# Altium project Hat.PrjPcb
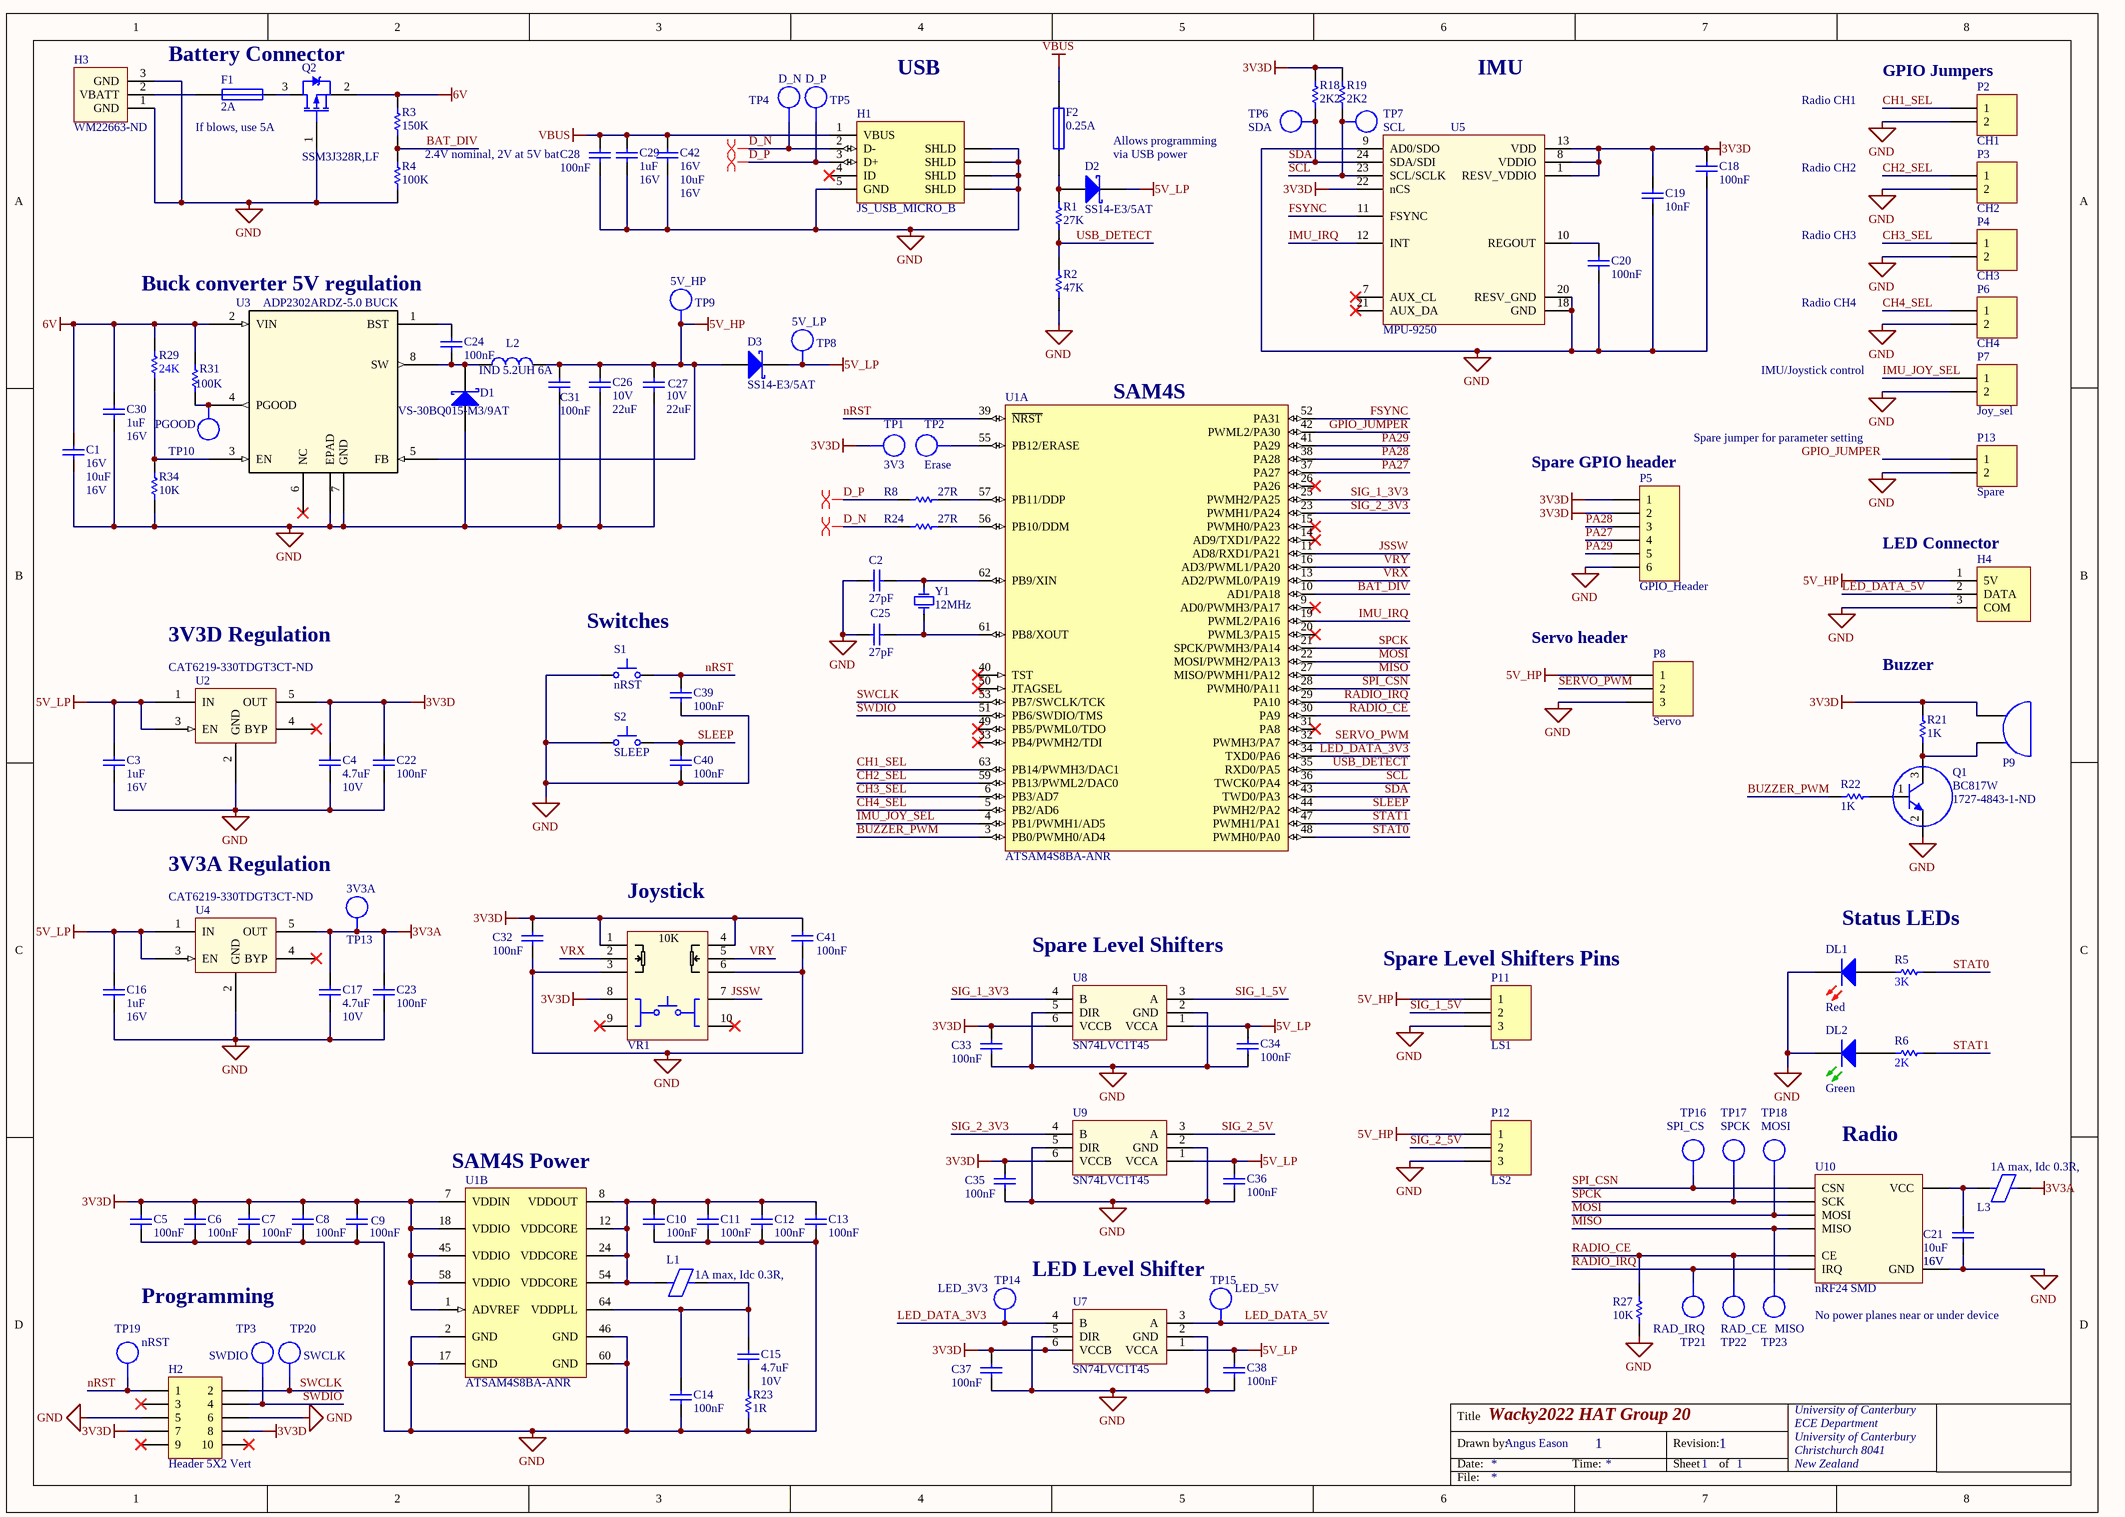
[diagram p0: MCU.SchDoc]
1 sheet, 120 parts. Net scope: global (net labels, ports and power ports of the same name join across sheets).
Board file: hat.PcbDoc

## Sheet MCU.SchDoc: Wacky2022 HAT Group 20
size A3; DrawnBy: Angus Eason; Organization: University of Canterbury; Address1: ECE Department; Address2: University of Canterbury; Address3: Christchurch 8041; Address4: New Zealand; DocumentNumber: 1; Revision: 1; SheetNumber: 1; SheetTotal: 1; ImagePath: C:\Users\angus\Documents\Altium\Templates\uc-logo.png

### Parts
C1  Voltage - Rated: 16V  [CAPC2012L]  (hidden comment: 10uF)
C2  27pF  [CAPC1608L]
C3  Max Voltage: 16V  [CAPC1608L]  (hidden comment: 1uF)
C4  Max Voltage: 10V  [CAPC1608N]  (hidden comment: 4.7uF)
C5  100nF  [CAPC1608L]
C6  100nF  [CAPC1608L]
C7  100nF  [CAPC1608L]
C8  100nF  [CAPC1608L]
C9  100nF  [CAPC1608L]
C10  100nF  [CAPC1608L]
C11  100nF  [CAPC1608L]
C12  100nF  [CAPC1608L]
C13  100nF  [CAPC1608L]
C14  100nF  [CAPC1608L]
C15  Max Voltage: 10V  [CAPC1608N]  (hidden comment: 4.7uF)
C16  Max Voltage: 16V  [CAPC1608L]  (hidden comment: 1uF)
C17  Max Voltage: 10V  [CAPC1608N]  (hidden comment: 4.7uF)
C18  100nF  [CAPC1608L]
C19  10nF  [CAPC1608L]
C20  100nF  [CAPC1608L]
C21  Voltage - Rated: 16V  [CAPC2012L]  (hidden comment: 10uF)
C22  100nF  [CAPC1608L]
C23  100nF  [CAPC1608L]
C24  100nF  [CAPC1608L]
C25  27pF  [CAPC1608L]
C26  Max Voltage: 10V  [CAPC3216L]  (hidden comment: 22uF)
C27  Max Voltage: 10V  [CAPC3216L]  (hidden comment: 22uF)
C28  100nF  [CAPC1608L]
C29  Max Voltage: 16V  [CAPC1608L]  (hidden comment: 1uF)
C30  Max Voltage: 16V  [CAPC1608L]  (hidden comment: 1uF)
C31  100nF  [CAPC1608L]
C32  100nF  [CAPC1608L]
C33  100nF  [CAPC1608L]
C34  100nF  [CAPC1608L]
C35  100nF  [CAPC1608L]
C36  100nF  [CAPC1608L]
C37  100nF  [CAPC1608L]
C38  100nF  [CAPC1608L]
C39  100nF  [CAPC1608L]
C40  100nF  [CAPC1608L]
C41  100nF  [CAPC1608L]
C42  Voltage - Rated: 16V  [CAPC2012L]  (hidden comment: 10uF)
D1  VS-30BQ015-M3/9AT  [SMC]
D2  SS14-E3/5AT  [DIOM4227X23N]
D3  SS14-E3/5AT  [DIOM4227X23N]
DL1  Red  [WL-SMCW0603]
DL2  Green  [WL-SMCW0603]
F1  2A  [RESC3216N]
F2  0.25A  [RESC3216N]
H1  JS_USB_MICRO_B  [FCI_USB_10118194-0001LF]
H2  Header 5X2 Vert  [IDC2.54-V10D]
H3  Supplier Part Number 1: WM22663-ND  [BATT_HEADER_3POS]  (hidden comment: Battery_HEADER_3pin)
H4  LED_Strip  [MOLEX_KK_3_HDR]  (value not drawn)
L1  1A max, Idc 0.3R,  [INDC3216L]
L2  IND 5.2UH 6A  [INDUCTOR5u2]
L3  1A max, Idc 0.3R,  [INDC3216L]
P2  CH1  [HDR1X2]
P3  CH2  [HDR1X2]
P4  CH3  [HDR1X2]
P5  GPIO_Header  [HDR1X6]
P6  CH4  [HDR1X2]
P7  Joy_sel  [HDR1X2]
P8  Servo  [HDR1X3]
P9  Piezo Buzzer  [BUZZER]  (value not drawn)
P11  LS1  [HDR1X3]
P12  LS2  [HDR1X3]
P13  Spare  [HDR1X2]
Q1  Supplier Part Number 2: 1727-4843-1-ND  [SOT323_M]  (hidden comment: BC817W)
Q2  SSM3J328R,LF  [SOT23_L]
R1  27K  [RESC1608L]
R2  47K  [RESC1608N]
R3  150K  [RESC1608L]
R4  100K  [RESC1608L]
R5  3K  [RESC1608L]
R6  2K  [RESC1608L]
R8  27R  [RESC1608L]
R18  2K2  [RESC1608L]
R19  2K2  [RESC1608L]
R21  1K  [RESC1608L]
R22  1K  [RESC1608L]
R23  1R  [RESC3216L]
R24  27R  [RESC1608L]
R27  10K  [RESC1608L]
R29  24K  [RESC1608L]
R31  100K  [RESC1608L]
R34  10K  [RESC1608L]
S1  nRST  [EVQPNF05M]
S2  SLEEP  [EVQPNF05M]
TP1  3V3  [TP_1206]  (no BOM)
TP2  Erase  [TP_1206]  (no BOM)
TP3  SWDIO  [TP_1206]  (no BOM)
TP4  D_N  [TP_1206]  (no BOM)
TP5  D_P  [TP_1206]  (no BOM)
TP6  SDA  [TP_1206]  (no BOM)
TP7  SCL  [TP_1206]  (no BOM)
TP8  5V_LP  [TP_1206]  (no BOM)
TP9  5V_HP  [TP_1206]  (no BOM)
TP10  PGOOD  [TP_1206]  (no BOM)
TP13  3V3A  [TP_1206]  (no BOM)
TP14  LED_3V3  [TP_1206]  (no BOM)
TP15  LED_5V  [TP_1206]  (no BOM)
TP16  SPI_CS  [TP_1206]  (no BOM)
TP17  SPCK  [TP_1206]  (no BOM)
TP18  MOSI  [TP_1206]  (no BOM)
TP19  nRST  [TP_1206]  (no BOM)
TP20  SWCLK  [TP_1206]  (no BOM)
TP21  RAD_IRQ  [TP_1206]  (no BOM)
TP22  RAD_CE  [TP_1206]  (no BOM)
TP23  MISO  [TP_1206]  (no BOM)
U1  ATSAM4S8BA-ANR  [LQFP64_L]  (parts A,B of 2)
U2  Supplier Part Number: CAT6219-330TDGT3CT-ND  [SOT95P280X145-5N]  (hidden comment: CAT6219-330TDGT3)
U3  ADP2302ARDZ-5.0 BUCK  [RD_8_1]
U4  Supplier Part Number: CAT6219-330TDGT3CT-ND  [SOT95P280X145-5N]  (hidden comment: CAT6219-330TDGT3)
U5  MPU-9250  [Quad24]
U7  SN74LVC1T45  [SOT23-6_N]
U8  SN74LVC1T45  [SOT23-6_N]
U9  SN74LVC1T45  [SOT23-6_N]
U10  nRF24 SMD  Warning: No power planes near or under device  [NRF24]
VR1  Joystick 10k with Sw  [Joystick_Sw]  (value not drawn)
Y1  12MHz  [6.0X3.5-4]

### Nets
3V3A: C17.2 C23.2 L3.2 TP13.1 U4.5(OUT)
3V3D: C4.2 C5.2 C6.2 C7.2 C8.2 C9.2 C18.1 C19.2 C22.2 C32.2 C33.2 C35.2 C37.2 C41.2 H2.7 H2.8 P5.1 P5.2 P9.1 R18.2 R19.2 R21.2 TP1.1 U1.1(ADVREF) U1.7(VDDIN) U1.18(VDDIO) U1.45(VDDIO) U1.58(VDDIO) U2.5(OUT) U5.1(RESV_VDDIO) U5.8(VDDIO) U5.13(VDD) U5.22(nCS) U7.6(VCCB) U8.6(VCCB) U9.6(VCCB) VR1.1 VR1.4(1') VR1.8
5V_HP: C26.2 C27.2 C31.1 D3.2(A) H4.1(5V) L2.2 P8.1 P11.1 P12.1 TP9.1 U3.5(FB)
5V_LP: C3.2 C16.2 C34.1 C36.1 C38.1 D2.1(K) D3.1(K) TP8.1 U2.1(IN) U2.3(EN) U4.1(IN) U4.3(EN) U7.1(VCCA) U8.1(VCCA) U9.1(VCCA)
6V: C1.2 C30.2 Q2.2 R3.2 R29.2 R31.2 U3.2(VIN)
GND: C1.1 C2.1 C3.1 C4.1 C5.1 C6.1 C7.1 C8.1 C9.1 C10.1 C11.1 C12.1 C13.1 C14.1 C16.1 C17.1 C18.2 C19.1 C20.1 C21.1 C22.1 C23.1 C25.1 C26.1 C27.1 C28.1 C29.1 C30.1 C31.2 C32.1 C33.1 C34.2 C35.1 C36.2 C37.1 C38.2 C39.2 C40.2 C41.1 C42.1 D1.1(A) DL1.1(K) DL2.1(K) H1.5(GND) H1.6(SHLD) H2.5 H2.6 H3.1(GND) H3.3(GND) H4.3(COM) P2.2 P3.2 P4.2 P5.6 P6.2 P7.2 P8.3 P11.3 P12.3 P13.2 Q1.2 Q2.1 R2.1 R4.1 R23.1 R27.1 R34.1 S1.1 S2.1 U1.2(GND) U1.17(GND) U1.46(GND) U1.60(GND) U2.2(GND) U3.7(GND) U3.EPAD U4.2(GND) U5.9(AD0/SDO) U5.18(GND) U5.20(RESV_GND) U7.2(GND) U7.5(DIR) U8.2(GND) U8.5(DIR) U9.2(GND) U9.5(DIR) U10.2(GND) VR1.3 VR1.6(3')
VBUS: C28.2 C29.2 C42.2 F2.2 H1.1(VBUS)
BAT_DIV: R3.1 R4.2 U1.10(AD1/PA18)
BUZZER_PWM: R22.2 U1.3(PB0/PWMH0/AD4)
CH1_SEL: P2.1 U1.63(PB14/PWMH3/DAC1)
CH2_SEL: P3.1 U1.59(PB13/PWML2/DAC0)
CH3_SEL: P4.1 U1.6(PB3/AD7)
CH4_SEL: P6.1 U1.5(PB2/AD6)
D_N: H1.2(D-) R24.1 TP4.1
D_P: H1.3(D+) R8.1 TP5.1
FSYNC: U1.52(PA31) U5.11(FSYNC)
GPIO_JUMPER: P13.1 U1.42(PWML2/PA30)
IMU_IRQ: U1.19(PWML2/PA16) U5.12(INT)
IMU_JOY_SEL: P7.1 U1.4(PB1/PWMH1/AD5)
JSSW: U1.11(AD8/RXD1/PA21) VR1.7
LED_DATA_3V3: TP14.1 U1.34(TXD0/PA6) U7.4(B)
LED_DATA_5V: H4.2(DATA) TP15.1 U7.3(A)
MISO: TP23.1 U1.27(MISO/PWMH1/PA12) U10.7(MISO)
MOSI: TP18.1 U1.22(MOSI/PWMH2/PA13) U10.6(MOSI)
nRST: C39.1 H2.1 S1.2 TP19.1 U1.39(~{NRST})
PA27: P5.4 U1.37(PA27)
PA28: P5.3 U1.38(PA28)
PA29: P5.5 U1.41(PA29)
RADIO_CE: R27.2 TP22.1 U1.30(PA9) U10.3(CE)
RADIO_IRQ: TP21.1 U1.29(PA10) U10.8(IRQ)
SCL: R19.1 TP7.1 U1.36(TWCK0/PA4) U5.23(SCL/SCLK)
SDA: R18.1 TP6.1 U1.43(TWD0/PA3) U5.24(SDA/SDI)
SERVO_PWM: P8.2 U1.32(PWMH3/PA7)
SIG_1_3V3: U1.25(PWMH2/PA25) U8.4(B)
SIG_1_5V: P11.2 U8.3(A)
SIG_2_3V3: U1.23(PWMH1/PA24) U9.4(B)
SIG_2_5V: P12.2 U9.3(A)
SLEEP: C40.1 S2.2 U1.44(PWMH2/PA2)
SPCK: TP17.1 U1.21(SPCK/PWMH3/PA14) U10.5(SCK)
SPI_CSN: TP16.1 U1.28(PWMH0/PA11) U10.4(CSN)
STAT0: R5.2 U1.48(PWMH0/PA0)
STAT1: R6.2 U1.47(PWMH1/PA1)
SWCLK: H2.2 TP20.1 U1.53(PB7/SWCLK/TCK)
SWDIO: H2.4 TP3.1 U1.51(PB6/SWDIO/TMS)
USB_DETECT: R1.1 R2.2 U1.35(RXD0/PA5)
VRX: U1.13(AD2/PWML0/PA19) VR1.2
VRY: U1.16(AD3/PWML1/PA20) VR1.5(2')
NetC2_2: C2.2 U1.62(PB9/XIN) Y1.3(OSC2)
NetC10_2: C10.2 C11.2 C12.2 C13.2 L1.2 U1.8(VDDOUT) U1.12(VDDCORE) U1.24(VDDCORE) U1.54(VDDCORE)
NetC14_2: C14.2 C15.2 L1.1 U1.64(VDDPLL)
NetC15_1: C15.1 R23.2
NetC20_2: C20.2 U5.10(REGOUT)
NetC21_2: C21.2 L3.1 U10.1(VCC)
NetC24_1: C24.1 U3.1(BST)
NetC24_2: C24.2 D1.2(K) L2.1 U3.8(SW)
NetC25_2: C25.2 U1.61(PB8/XOUT) Y1.1(OSC1)
NetD2_2: D2.2(A) F2.1 R1.2
NetDL1_2: DL1.2(A) R5.1
NetDL2_2: DL2.2(A) R6.1
NetF1_1: F1.1 H3.2(VBATT)
NetF1_2: F1.2 Q2.3
NetP9_2: P9.2 Q1.3 R21.1
NetQ1_1: Q1.1 R22.1
NetR8_2: R8.2 U1.57(PB11/DDP)
NetR24_2: R24.2 U1.56(PB10/DDM)
NetR29_1: R29.1 R34.2 U3.3(EN)
NetR31_1: R31.1 TP10.1 U3.4(PGOOD)
NetTP2_1: TP2.1 U1.55(PB12/ERASE)

Not connected (* = marked no-connect by the designer): H1 4(ID)*; H2 3* 9* 10*; U1 9(AD0/PWMH3/PA17)* 14(AD9/TXD1/PA22)* 15(PWMH0/PA23)* 20(PWML3/PA15)* 26(PA26)* 31(PA8)* 33(PB4/PWMH2/TDI)* 40(TST)* 49(PB5/PWML0/TDO)* 50(JTAGSEL)*; U2 4(BYP)*; U3 6(NC)*; U4 4(BYP)*; U5 7(AUX_CL)* 21(AUX_DA)*; VR1 9* 10*

### Layout directives
differential pair: D_N, D_P

### Notes on the sheet
- Battery Connector
- USB
- IMU
- Radio CH1
- (near P2) GPIO Jumpers
- (near Q2) If blows, use 5A
- 2.4V nominal, 2V at 5V bat
- Allows programming
- (near D2) via USB power
- Radio CH2
- Radio CH3
- Buck converter 5V regulation
- Radio CH4
- IMU/Joystick control
- (near U1) SAM4S
- Spare jumper for parameter setting
- (near P5) Spare GPIO header
- (near H4) LED Connector
- 3V3D Regulation
- Switches
- (near P8) Servo header
- (near R21) Buzzer
- 3V3A Regulation
- (near VR1) Joystick
- Status LEDs
- (near U8) Spare Level Shifters
- (near P11) Spare Level Shifters Pins
- (near U1) SAM4S Power
- (near U10) Radio
- Programming
- LED Level Shifter
- Title
- Drawn by:
- Date:
- Time:
- Revision:
- Sheet
- of
- File:
- (in symbol Joystick 10k with Sw) 10K

### Library data of the parts
C1 C21 C42 = CC_10uF_0805_16V: CAP CER 10uF X5R 16V 0805; Manufacturer: Samsung Electro-Mechanics; Manufacturer Part Number: CL21A106KOQNNWE; Note: Footprint corresponds to dimensions for bulk cassette packaging. This case size has tightened tolerances.; Tolerance: ±10%; Notification: Current market demand for these product types have resulted in fluctuating and extending lead times. Lead times may differ.; PackageReference: 0805; Code_IPC: 2012[0805]; Supplier 1: Digi-Key; RoHS: RoHS Compliant; Category: Capacitors; Stock 1: 20000; Pricing 1: 1=0.35, 10=0.25, 100=0.1178, 500=0.08254, 1000=0.06831 (NZD); Packaging: Cut Tape (CT); Part Status: Active; Temperature Coefficient: X5R; Operating Temperature: -55°C ~ 85°C; Features: -; Ratings: -; Applications: General Purpose; Mounting Type: Surface Mount, MLCC; Package / Case: 0805 (2012 Metric); Size / Dimension: 0.079" L x 0.049" W (2.00mm x 1.25mm); Height - Seated (Max): -; Thickness (Max): 0.055" (1.40mm); Lead Spacing: -; Lead Style: -; ComponentLink1URL: http://www.samsungsem.com/kr/support/product-search/mlcc/CL21A106KOQNNWE.jsp; ComponentLink1Description: http://www.samsungsem.com/kr/support/product-search/mlcc/CL21A106KOQNNWE.jsp; Supplier Part Number 1: 1276-2894-1-ND; Value: 10uF; Max Voltage: 16V
C2 C25 = CC_27pF_0603: CAP CER 27pF NPO/COG +-5% 50V 0603; PackageReference: 0603; Code_IPC: 1608 [0603]; Verify: *; Supplier: ECE Dept; Storage Location: PCB Assembly WS; Value: 27pF
C3 C16 C29 C30 = CC_1uF_0603: CAP CER 1uF Y5V -20% +80% 16V 0603; PackageReference: 0603; Code_IPC: 1608 [0603]; Verify: *; Supplier: ECE Dept; Storage Location: PCB Assembly WS; Value: 1uF
C4 C15 C17 = CC_4.7uF_0603: CAP CER 4.7uF X5R +-20%  10V 0603; Note: Footprint corresponds to dimensions for bulk cassette packaging. This case size has tightened tolerances.; PackageReference: 0805; Code_IPC: 2012[0805]; Verify: *; Supplier: ECE Dept; Storage Location: PCB Assembly WS; Value: 4.7uF
C5-C14 C18 C20 C22-C24 C28 C31-C41 = CC_100nF_0603: CAP CER 100nF X7R +-10% 50V 0603; PackageReference: 0603; Code_IPC: 1608 [0603]; Verify: *; Supplier: ECE Dept; Storage Location: PCB Assembly WS; Value: 100nF
C19 = CC_10nF_0603: CAP CER 10nF X7R +-10% 50V 0603; PackageReference: 0603; Code_IPC: 1608 [0603]; Verify: *; Supplier: ECE Dept; Storage Location: PCB Assembly WS; Value: 10nF
C26 C27 = CC_22uF_1206: CAP CER 22uF Y5V -20% +80% 10V 1206; Verify: *; Supplier: ECE Dept; Storage Location: PCB Assembly WS; Dielectric: Y5V; Footprint: 1206 (3216 metric); Value: 22uF
D1 = DS_VS-30BQ015-M3: DIODE, SCHOTTKY, 3A, 15V, DO-214AB / SMC; Manufacturer: Vishay Semiconductors; Forward Voltage: 350mV; Max Forward Surge Current (Ifsm): 650A; Peak Reverse Current: 4mA; Average Rectified Current: 3A; Max Reverse Voltage (DC): 15V; Supplier: Digi-Key; ComponentLink1URL: https://datasheet.ciiva.com/36181/vs-30bq015-m3-9at-36181258.pdf; ComponentLink1Description: https://datasheet.ciiva.com/36181/vs-30bq015-m3-9at-36181258.pdf; Supplier 1: Digi-Key; Supplier 2: Element14; Supplier Part Number 1: VS-30BQ015-M3/9ATGIDKR-ND; Supplier Part Number 2: 2628288; Supplier Part Number: VS-30BQ015-M3/9AT-ND; Manufacturer Part Number: VS-30BQ015-M3/9AT
D2 D3 = DS_SS14E3: DIODE, SCHOTTKY, 1A, 40V, DO-214AC; Manufacturer: VISHAY GENERAL SEMICONDUCTOR; Diode Case Style: DO-214; Forward Current If(AV): 1; Diode Type: Schottky; Package / Case: SMA; Supplier 1: Digi-Key; Supplier Part Number 1: SS14-E3/5ATGICT-ND; Supplier 2: Farnell; Supplier Part Number 2: 9551280; Supplier 3: Mouser; Supplier Part Number 3: 625-SS14-E3/11T; Storage Location: PCB Assembly WS; Supplier: ECE Dept; Manufacturer Part Number: SS14-E3/5AT
DL1 = DL_150060RS75000: LED Red 250mcd 0603 SMD; Manufacturer: WURTH ELEKTRONIK; Forward Current If: 30; Forward Voltage: 2; Lens Shape: Rectangular; Luminous Intensity: 250; Wavelength Typ: 625; Viewing Angle: 140°; LED Mounting: SMD; Supplier 1: Farnell; Supplier Part Number 1: 2322071; Manufacturer Part Number: 150060RS75000; Storage Location: PCB Assembly WS; Supplier: ECE Dept; LED Colour: Red
DL2 = DL_150060GS75000: LED Green 430mcd 0603 SMD; Manufacturer: WURTH ELEKTRONIK; Forward Current If: 30; Wavelength Typ: 520; Forward Voltage: 3.2; Lens Shape: Rectangular; Luminous Intensity: 430; Viewing Angle: 140°; LED Mounting: SMD; Supplier 1: Farnell; Supplier Part Number 1: 2322070; Manufacturer Part Number: 150060GS75000; Storage Location: PCB Assembly WS; Supplier: ECE Dept; LED Colour: Green
F1 = FS_Fuse_2.0A: Fuse 2.0A Very Fast Acting 1206 SMD; Manufacturer: MULTICOMP; Manufacturer PN: MC12CF 002; Supplier: ECE Dept; Storage Location: PCB Assembly WS; Supplier 1: Farnell; Supplier Part Number 1: 1841029; Manufacturer Part Number: MC12CF 002; Value: 2A
F2 = FS_Fuse_0.25A: Fuse 0.25A Very Fast Acting 1206 SMD; Manufacturer: MULTICOMP; Manufacturer PN: MC12CF.250; Breaking Capacity: 50A @ 32V AC / 63; Device Marking: D; Fuse Case Style: 1206; Fuse Current: 250; Supplier: ECE Dept; Storage Location: PCB Assembly WS; Blow Characteristic: Very Fast Acting; Fuse Type Blowing Characteristic: Very Fast Acting; Supplier 1: Farnell; Supplier Part Number 1: 1841020; Manufacturer Part Number: MC12CF.250; Value: 0.25A
H1 = JS_USB_MICRO_B_SMT: CONN USB MICRO B RECPT SMT R/A; Manufacturer: FCI; Manufacturer Part Number: 10118194-0001LF; Gender: Receptacle; Number of Contacts: 5; Specifications: USB 2.0; Supplier 1: Digi-Key; Supplier Part Number 1: 609-4618-1-ND; Features: Shielded, Solder Retention; Mounting Type: Surface Mount, Right Angle, Horizontal
H2 = JA_HDR_IDC_5X2_VERT: IDC Header, 2,54mm, 10-Pin, Vert; Supplier: ECE Dept; Supplier 1: Farnell; Supplier Part Number 1: 1096985; Storage Location: ECE Dept Store
H3 = Battery_HEADER_3pin: 3Pin Header 2.54mm spacing / Digikey #WM22663-ND; Supplier 1: Digi-Key
H4 = LED_Strip_Header: CONN HEADER 3POS 2.54mm VERT_Thru Hole; Manufacturer: Molex; Value: 3 Pin Molex KK Hdr; Manufacturer PN: 22-23-2031; Supplier Part Number 1: 9731156; Supplier: ECE Dept; Supplier 1: Farnell; Storage Location: ECE Dept Store
L1 L3 = IN_Ferrite-Bead: Ferrite Bead, Rdc 0.3R, Z100MHZ 600R, Imax 1A, SMD 1206; Manufacturer: FAIR-RITE; Manufacturer PN: 2512066017Y1; DC Current Rating: 1; DC Resistance Max: 0.08; Ferrite Case Style: 1206 ^3216 Metric]; Frequency Range: 50MHz to 1; Impedance: 600; Impedance Tolerance: ± 25%; Supplier: ECE Dept; Storage Location: PCB Assembly WS; Ferrite Mounting: SMD; Supplier 1: Farnell; Supplier Part Number 1: 1612060; Manufacturer Part Number: 2512066017Y1; Value: 1A max, Idc 0.3R,
L2 = CDRH104RNP-5R2NC: FIXED IND 5.2UH 6A 22 MOHM SMD; Manufacturer: Sumida America Components Inc.; Material - Core: Ferrite; Tolerance: ±30%; Current - Saturation: 5.6A; Shielding: Shielded; DC Resistance (DCR): 22 mOhm Max; Supplier 1: Digi-Key; Manufacturer Part Number: CDRH104RNP-5R2NC; RoHS: RoHS Compliant; Category: Inductors, Coils, Chokes; Stock 1: 3849; Pricing 1: 1=2.9, 10=2.678, 100=1.8743, 500=1.5173 (NZD); Packaging: Cut Tape (CT); Part Status: Active; Type: -; Q @ Freq: -; Frequency - Self Resonant: -; Ratings: -; Operating Temperature: -40°C ~ 100°C; Mounting Type: Surface Mount; Package / Case: Nonstandard; Supplier Device Package: -; Size / Dimension: 0.402" L x 0.394" W (10.20mm x 10.00mm); Height - Seated (Max): 0.157" (4.00mm); ComponentLink1URL: http://products.sumida.com/products/pdf/CDRH104R.pdf; ComponentLink1Description: http://products.sumida.com/products/pdf/CDRH104R.pdf; Supplier Part Number 1: 308-2280-1-ND
P2-P4 P6 P7 P13 = JA_PIN_Header 2: Header, 2-Pin; LatestRevisionDate: 17-Jul-2002; LatestRevisionNote: Re-released for DXP Platform.; Publisher: Altium Limited
P5 = JA_PIN_Header 6: Header, 6-Pin; LatestRevisionDate: 17-Jul-2002; LatestRevisionNote: Re-released for DXP Platform.; Publisher: Altium Limited
P8 P11 P12 = JA_PIN_Header 3: Header, 3-Pin; LatestRevisionDate: 17-Jul-2002; LatestRevisionNote: Re-released for DXP Platform.; Publisher: Altium Limited
P9 = Piezo Buzzer: TDK - PS1240P02BT - BUZZER, PIEZO, 70DB, 12.2MM; Number of Terminals/Pins: 2; Frequency: 4kHz; Operating Supply Voltage: 3V; Washable: No; Supplier 1: Digi-Key; Manufacturer 1: TDK; Manufacturer Part Number 1: PS1240P02BT; Stock 1: 24025; Pricing 1: 1=0.61000, 10=0.52500, 25=0.49120, 50=0.46580, 100=0.44110 (USD); RoHS: Yes; Mount: Through Hole; Number of Pins: 2; Min Operating Temperature: -10°C; Max Operating Temperature: 70°C; Package Quantity: 1; Packaging: Tape and Reel; Termination: PC Pins; Voltage Rating (DC): 3V; Series: PS; Diameter: 12.2mm; Height: 6.5mm; Lead Free: Lead Free; RoHS Compliant: Yes; ComponentLink1URL: https://datasheet.ciiva.com/0/ef532-ps-112.pdf?src-supplier=Digi-Key; ComponentLink1Description: https://datasheet.ciiva.com/0/ef532-ps-112.pdf?src-supplier=Digi-Key; ComponentLink2URL: https://datasheet.ciiva.com/0/ef532-ps-111.pdf?src-supplier=Digi-Key; ComponentLink2Description: https://datasheet.ciiva.com/0/ef532-ps-111.pdf?src-supplier=Digi-Key; ComponentLink3URL: https://datasheet.ciiva.com/3306/ef532-ps-3306958.pdf?src-supplier=Avnet; ComponentLink3Description: https://datasheet.ciiva.com/3306/ef532-ps-3306958.pdf?src-supplier=Avnet; ComponentLink4URL: https://datasheet.ciiva.com/16225/ef532-ps-16225062.pdf?src-supplier=Onlinecomponents.com; ComponentLink4Description: https://datasheet.ciiva.com/16225/ef532-ps-16225062.pdf?src-supplier=Onlinecomponents.com; Supplier Part Number 1: 445-2525-1-ND
Q1 = TB_BC817W: NPN GP Bipolar Transistor 45V 500mA SOT323; Manufacturer: NXP; Supplier 1: Farnell; Supplier Part Number 1: 2114873; Manufacturer PN: BC817W; Storage Location: PCB Assembly WS; Supplier: ECE Dept; Supplier 2: Digi-Key; Value: BC817W
Q2 = TM_SSM3J328R: MOSFET P-CH 20V 6A SOT23-3; Manufacturer: Toshiba; FET Feature: Logic Level Gate, 1.5V Drive; FET Type: MOSFET P-Channel, Metal Oxide; Gate Charge (Qg) @ Vgs: 12.8nC @ 4.5V; Input Capacitance (Ciss) @ Vds: 840pF @ 10V; Power - Max: 1W; Rds On Max: 29.8mR; Drain to Source Resistance: 47.4mR; Turn-On Delay Time: 32ns; Power Dissipation: 2W; Number of Channels: 1; Turn-Off Delay Time: 107ns; Gate to Source Voltage (Vgs): 8V; Input Capacitance: 840pF; Element Configuration: Single; Drain to Source Breakdown Voltage: -20V; Vgs(th) (Max) @ Id: 1V @ 1mA; Current - Continuous Drain (Id) @ 25° C: 6A; Drain to Source Voltage (Vdss): 20V; Package / Case: SOT-23-3 Flat Leads; Supplier Device Package: SOT-23F; Pricing: 1=0.79, 10=0.658, 25=0.5772, 100=0.4939, 250=0.42836, 500=0.36284, 1000=0.27972 (NZD); Storage Location: PCB Assembly WS; Supplier: Digi-Key; ComponentLink1URL: https://datasheet.ciiva.com/11158/ssm3j328r-datasheet-en-20140301-11158652.pdf; ComponentLink1Description: https://datasheet.ciiva.com/11158/ssm3j328r-datasheet-en-20140301-11158652.pdf; Supplier Part Number: SSM3J328RLFDKR-ND; Max Operating Temperature: 150°C; Mount: Surface Mount; Packaging: Tape and Reel; Min Operating Temperature: -55°C; Continuous Drain Current (ID): 6A; Radiation Hardening: No; Max Power Dissipation: 1W; Package Quantity: 3000; Case/Package: SOT-23-3; Number of Pins: 3; Number of Elements: 1; Supplier 1: Digi-Key; Supplier Part Number 1: SSM3J328RLFDKR-ND; Manufacturer Part Number: SSM3J328R,LF
R1 = RS_27K: RES 27K OHM 1/10W 5% 0603 SMD; Storage Location: PCB Assembly WS; Supplier: ECE Dept; Value: 27K
R2 = RS_47K: RES 47.0K OHM 1/10W 5% 0603 SMD; Storage Location: PCB Assembly WS; Supplier: ECE Dept; Value: 47K
R3 = RS_150K: RES 150K OHM 1/10W 5% 0603 SMD; Storage Location: PCB Assembly WS; Supplier: ECE Dept; Value: 150K
R4 R31 = RS_100K: RES 100K OHM 1/10W 5% 0603 SMD; Storage Location: PCB Assembly WS; Supplier: ECE Dept; Value: 100K
R5 = RS_3K: RES 3K OHM 1/10W 5% 0603 SMD; Storage Location: PCB Assembly WS; Supplier: ECE Dept; Value: 3K
R6 = RS_2K: RES 2K OHM 1/10W 5% 0603 SMD; Storage Location: PCB Assembly WS; Supplier: ECE Dept; Value: 2K
R8 R24 = RS_27R: RES 27 OHM 1/10W 5% 0603 SMD; Storage Location: PCB Assembly WS; Supplier: ECE Dept; Value: 27R
R18 R19 = RS_2K2: RES 2.2K OHM 1/10W 5% 0603 SMD; Storage Location: PCB Assembly WS; Supplier: ECE Dept; Value: 2K2
R21 R22 = RS_1K: RES 1.0K OHM 1/10W 5% 0603 SMD; Storage Location: PCB Assembly WS; Supplier: ECE Dept; Value: 1K
R23 = RT_1R: RES 1R OHM 1/4W 5% 1206 SMD; Storage Location: PCB Assembly WS; Supplier: ECE Dept; Value: 1R
R27 R34 = RS_10K: RES 10.0K OHM 1/10W 5% 0603 SMD; Storage Location: PCB Assembly WS; Supplier: ECE Dept; Value: 10K
R29 = RS_24K: RES 24K OHM 1/10W 5% 0603 SMD; Storage Location: PCB Assembly WS; Supplier: ECE Dept; Value: 24K
S1 S2 = WS_EVQPNF05M: Panasonic 6 x 3.5mm SMD Light Touch Switch Type SMD; PackageDescription: 6.0 x 3.5 mm; Supplier 1: Farnell; Supplier Part Number 1: 2079481; Manufacturer: Panasonic; Manufacturer PN: EVQPNF05M; Supplier 2: Digi-Key; Supplier Part Number 2: P13598SCT-ND; Storage Location: PCB Assembly WS; Supplier: ECE Dept
TP1-TP10 TP13-TP23 = TP_1206: Test-Point 3.3x1.6x2.1mm SMD; Manufacturer: Harwin Inc; Manufacturer Part Number: S1751-46R; Value: TP; Manufacturer PN: *; Storage Location: ProtoPlace; Mounting Type: Surface Mount; Type: PC Test Point; Supplier 1: Digi-Key; Supplier Part Number 1: 952-1478-2-ND; Supplier 2: Farnell; Supplier Part Number 2: 1826282; Supplier: ECE Dept
U1 = SE_ATSAM4S16BA-MU: IC MCU 32BIT 512KB FLASH 64LQFP; Manufacturer: Atmel; Connectivity: I²C, IrDA, Memory Card, SPI, SSC, UART/USART, USB; Core Processor: ARM® Cortex®-M4; Core Size: 32-Bit; Data Converters: A/D 11x12b, D/A 2x12b; Number of I/O: 47; Peripherals: Brown-out Detect/Reset, DMA, POR, PWM, WDT; Program Memory Size: 512KB (512K x 8); RAM Size: 128K x 8; Speed: 120MHz; Voltage - Supply (Vcc/Vdd): 1.62 V ~ 3.6 V; PackageVersion: revJ, Jul-2007; PackageReference: 64PS; PackageDescription: 64-Pin Quad Flat No-Lead (QFN) Sawn, 9 x 9 x 1.0 mm Body, 0.5 mm Pitch, Exposed Pad; Code_JEDEC: MO-220VMMD-3; ComponentLink1Description: Manufacturer URL; ComponentLink1URL: http://www.atmel.com/; ComponentLink2Description: SAM4S Series Datasheet; ComponentLink2URL: http://www.atmel.com/dyn/resources/prod_documents/11100.pdf; ComponentLink3Description: SAM4S Series Summary; ComponentLink3URL: http://www.atmel.com/dyn/resources/prod_documents/11100S.pdf; Supplier 1: Digi-Key; Package / Case: 64-LQFP; Packaging: Cut Tape (CT); Program Memory Type: FLASH; Supplier Part Number 1: ATSAM4S8BA-ANRCT-ND; Manufacturer Part Number: ATSAM4S8BA-ANR
U2 U4 = SV_CAT6219-330TDGT3: IC REG LIN 3.3V 500MA TSOT23-5; Voltage - Input (Max): 5.5V; Voltage Dropout (Max): 0.5V @ 500mA; Manufacturer Part Number: CAT6219-330TDGT3; Base Part Number: CAT6219; Current - Output: 500mA; Package / Case: SOT-23-5 Thin, TSOT-23-5; Supplier: Digi-Key; Supplier Device Package: TSOT-23-5; Voltage - Output (Min/Fixed): 3.3V; ComponentLink1URL: http://www.onsemi.com/pub/Collateral/CAT6219-D.PDF; ComponentLink1Description: http://www.onsemi.com/pub/Collateral/CAT6219-D.PDF; Supplier 1: Digi-Key
U3 = ADP2302ARDZ-5.0-R7: IC REG BUCK 5V 2A 8SOIC; Vendor: Analog Devices Inc; Frequency - Switching: 700kHz; Output Type: Fixed; Voltage - Input (Max): 20V; Manufacturer_Part_Number: ADP2302ARDZ-5.0-R7; Type: DEV; Value: Value; Supplier 1: Digi-Key; Current - Output: 2A; Voltage - Output (Min/Fixed): 5V; Supplier Part Number 1: ADP2302ARDZ-5.0-R7CT-ND
U5 = MPU-9250: 9 axis IMU
U7-U9 = SN74LVC1T45: 1.8V - 5V level converter
U10 = NRF24: nRF24 SMD Module
VR1 = Joystick 10k with Sw: JOYSTICK 10K OHM 2 AXIS TH; Manufacturer 1: SparkFun; Manufacturer Part Number 1: COM-09032; Supplier 1: Digi-Key; Stock 1: 563; Pricing 1: 1=3.95000 (USD); RoHS: No; ComponentLink1URL: https://media.digikey.com/pdf/Data%20Sheets/Sparkfun%20PDFs/COM-09032_Web.pdf?src-supplier=Digi-Key; ComponentLink1Description: https://media.digikey.com/pdf/Data%20Sheets/Sparkfun%20PDFs/COM-09032_Web.pdf?src-supplier=Digi-Key; Supplier Part Number 1: 1568-1526-ND
Y1 = XT_CRYSTAL_12MHz_18pF: CRYSTAL 12MHZ 18PF 6X3.5mm SMD; Manufacturer: CTS-Frequency Controls; Manufacturer Part Number: 406C35D12M00000; ESR (Equivalent Series Resistance): 60 Ohm; Frequency Stability: ±50ppm; Frequency Tolerance: ±30ppm; Operating Mode: Fundamental; Supplier 1: Digi-Key; Height: 0.047" (1.20mm); Load Capacitance: 18pF; Mounting Type: Surface Mount; Operating Temperature: -20°C ~ 70°C; Package / Case: 4-SMD, No Lead (DFN, LCC); Size / Dimension: 0.236" L x 0.138" W (6.00mm x 3.50mm); Supplier Part Number 1: CTX855CT-ND; Frequency: 12MHz